# Altium schematic sheet Humidity&Temperature&Light.SchDoc
size A2
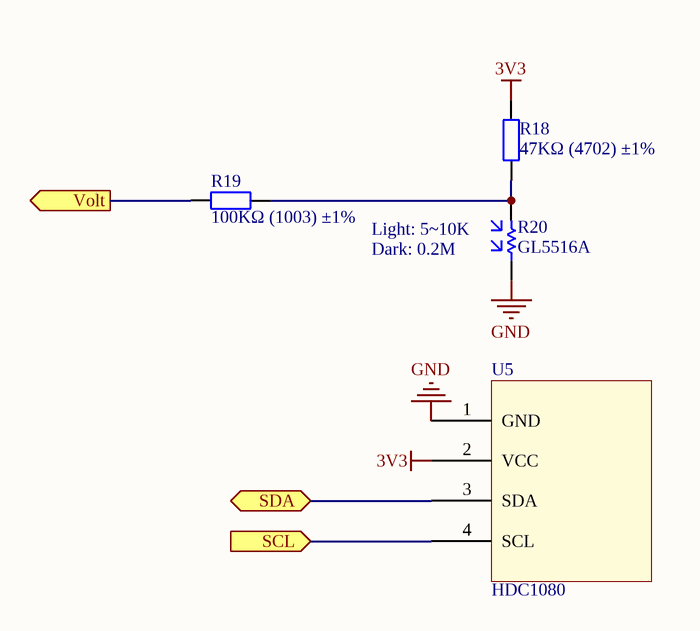
[diagram p0: Humidity&Temperature&Light.SchDoc]

## Parts
R18  47KΩ (4702) ±1%  [0603_R]
R19  100KΩ (1003) ±1%  [0603_R]
R20  GL5516A  [GL5516A]
U5  HDC1080  [HDC1080]

## Ports
SCL (in), SDA (bidir), Volt (out)

## Nets
3V3: R18.2 U5.2(VCC)
GND: R20.1 U5.1(GND)
SCL: U5.4(SCL) ; port SCL
SDA: U5.3(SDA) ; port SDA
Volt: R19.1 ; port Volt
NetR18_1: R18.1 R19.2 R20.2

## Notes on the sheet
- (near R20) Light: 5~10K
- (near R20) Dark: 0.2M

## Library data of the parts
R18 = 0603 47KΩ (4702) 1%: 贴片电阻; ComponentLink1Description: 供应商链接; ComponentLink1URL: http://www.szlcsc.com/product/details_26562.html; Package: 0603; Supplier: LC; SuppliersPartNumber: C25819
R19 = 0603 100KΩ (1003) 1%: 贴片电阻; ComponentLink1Description: 供应商链接; ComponentLink1URL: http://www.szlcsc.com/product/details_26546.html; Package: 0603; Supplier: LC; SuppliersPartNumber: C25803